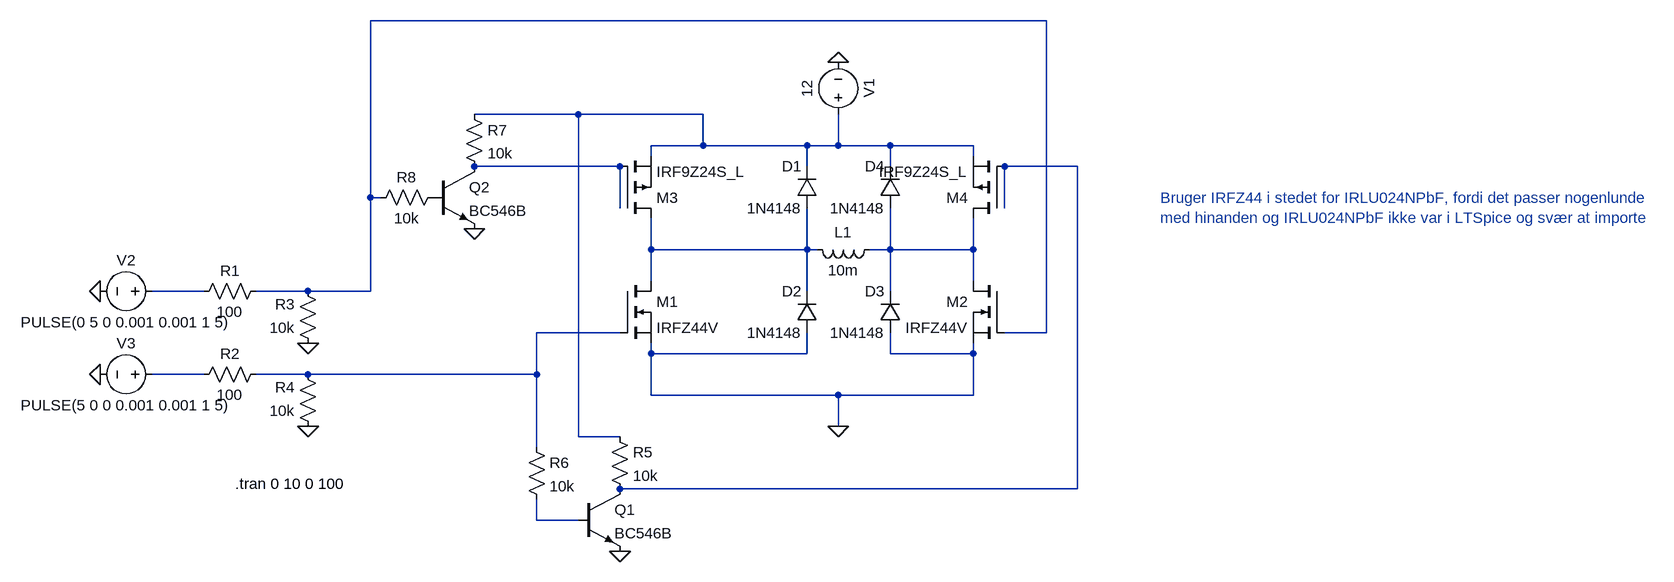
[diagram p0: schematic v1.asc]
v1.asc, the LTspice schematic file:
Version 4.1
SHEET 1 2684 680
WIRE 656 -288 -384 -288
WIRE -64 -144 -224 -144
WIRE 128 -144 -64 -144
WIRE 128 -96 128 -144
WIRE 128 -96 48 -96
WIRE 288 -96 128 -96
WIRE 336 -96 336 -144
WIRE 336 -96 288 -96
WIRE 416 -96 336 -96
WIRE 544 -96 416 -96
WIRE 48 -80 48 -96
WIRE 544 -80 544 -96
WIRE 0 -64 -224 -64
WIRE 288 -64 288 -96
WIRE 416 -64 416 -96
WIRE 704 -64 592 -64
WIRE -384 -16 -384 -288
WIRE -368 -16 -384 -16
WIRE 0 0 0 -64
WIRE 592 0 592 -64
WIRE 48 64 48 16
WIRE 288 64 288 0
WIRE 288 64 48 64
WIRE 304 64 288 64
WIRE 416 64 416 0
WIRE 416 64 384 64
WIRE 544 64 544 16
WIRE 544 64 416 64
WIRE 48 112 48 64
WIRE 544 112 544 64
WIRE -640 128 -720 128
WIRE -480 128 -560 128
WIRE -384 128 -384 -16
WIRE -384 128 -480 128
WIRE 288 128 288 64
WIRE 416 128 416 64
WIRE 0 192 -128 192
WIRE 656 192 656 -288
WIRE 656 192 592 192
WIRE 48 224 48 208
WIRE 288 224 288 192
WIRE 288 224 48 224
WIRE 416 224 416 192
WIRE 544 224 544 208
WIRE 544 224 416 224
WIRE -640 256 -720 256
WIRE -480 256 -560 256
WIRE -128 256 -128 192
WIRE -128 256 -480 256
WIRE 48 288 48 224
WIRE 336 288 48 288
WIRE 544 288 544 224
WIRE 544 288 336 288
WIRE 336 336 336 288
WIRE -64 352 -64 -144
WIRE 0 352 -64 352
WIRE -128 368 -128 256
WIRE 704 432 704 -64
WIRE 704 432 0 432
WIRE -128 480 -128 448
WIRE -64 480 -128 480
FLAG 336 336 0
FLAG -800 128 0
FLAG 336 -224 0
FLAG -800 256 0
FLAG -480 208 0
FLAG -480 336 0
FLAG -224 32 0
FLAG 0 528 0
SYMBOL nmos 0 112 R0
SYMATTR InstName M1
SYMATTR Value IRFZ44V
SYMBOL nmos 592 112 M0
SYMATTR InstName M2
SYMATTR Value IRFZ44V
SYMBOL voltage 336 -128 R180
WINDOW 0 -32 56 VBottom 2
WINDOW 3 32 56 VTop 2
WINDOW 123 0 0 Left 0
WINDOW 39 0 0 Left 0
SYMATTR InstName V1
SYMATTR Value 12
SYMBOL voltage -704 128 R90
WINDOW 0 -32 56 VBottom 2
WINDOW 3 32 56 VTop 2
WINDOW 123 0 0 Left 0
WINDOW 39 0 0 Left 0
SYMATTR InstName V2
SYMATTR Value PULSE(0 5 0 0.001 0.001 1 5)
SYMBOL ind 400 48 R90
WINDOW 0 5 56 VBottom 2
WINDOW 3 32 56 VTop 2
SYMATTR InstName L1
SYMATTR Value 10m
SYMBOL diode 304 0 R180
WINDOW 0 24 64 Left 2
WINDOW 3 24 0 Left 2
SYMATTR InstName D1
SYMATTR Value 1N4148
SYMBOL diode 304 192 R180
WINDOW 0 24 64 Left 2
WINDOW 3 24 0 Left 2
SYMATTR InstName D2
SYMATTR Value 1N4148
SYMBOL diode 432 192 R180
WINDOW 0 24 64 Left 2
WINDOW 3 24 0 Left 2
SYMATTR InstName D3
SYMATTR Value 1N4148
SYMBOL diode 432 0 R180
WINDOW 0 24 64 Left 2
WINDOW 3 24 0 Left 2
SYMATTR InstName D4
SYMATTR Value 1N4148
SYMBOL voltage -704 256 R90
WINDOW 0 -32 56 VBottom 2
WINDOW 3 32 56 VTop 2
WINDOW 123 0 0 Left 0
WINDOW 39 0 0 Left 0
SYMATTR InstName V3
SYMATTR Value PULSE(5 0 0 0.001 0.001 1 5)
SYMBOL res -544 112 R90
WINDOW 0 0 56 VBottom 2
WINDOW 3 32 56 VTop 2
SYMATTR InstName R1
SYMATTR Value 100
SYMBOL res -544 240 R90
WINDOW 0 0 56 VBottom 2
WINDOW 3 32 56 VTop 2
SYMATTR InstName R2
SYMATTR Value 100
SYMBOL res -464 224 R180
WINDOW 0 36 76 Left 2
WINDOW 3 36 40 Left 2
SYMATTR InstName R3
SYMATTR Value 10k
SYMBOL res -464 352 R180
WINDOW 0 36 76 Left 2
WINDOW 3 36 40 Left 2
SYMATTR InstName R4
SYMATTR Value 10k
SYMBOL pmos 0 16 M180
SYMATTR InstName M3
SYMATTR Value IRF9Z24S_L
SYMBOL pmos 592 16 R180
SYMATTR InstName M4
SYMATTR Value IRF9Z24S_L
SYMBOL npn -64 432 R0
SYMATTR InstName Q1
SYMATTR Value BC546B
SYMBOL npn -288 -64 R0
SYMATTR InstName Q2
SYMATTR Value BC546B
SYMBOL res -16 336 R0
SYMATTR InstName R5
SYMATTR Value 10k
SYMBOL res -240 -160 R0
SYMATTR InstName R7
SYMATTR Value 10k
SYMBOL res -144 352 R0
SYMATTR InstName R6
SYMATTR Value 10k
SYMBOL res -272 -32 R90
WINDOW 0 0 56 VBottom 2
WINDOW 3 32 56 VTop 2
SYMATTR InstName R8
SYMATTR Value 10k
TEXT -592 424 Left 2 !.tran 0 10 0 100
TEXT 832 -16 Left 2 ;Bruger IRFZ44 i stedet for IRLU024NPbF, fordi det passer nogenlunde\nmed hinanden og IRLU024NPbF ikke var i LTSpice og svær at importe

The netlist it stands for:
* v1.asc
M1 N005 N008 0 0 IRFZ44V
M2 N006 N001 0 0 IRFZ44V
V1 N002 0 12
V2 N007 0 PULSE(0 5 0 0.001 0.001 1 5)
L1 N006 N005 10m
D1 N005 N002 1N4148
D2 0 N005 1N4148
D3 0 N006 1N4148
D4 N006 N002 1N4148
V3 N009 0 PULSE(5 0 0 0.001 0.001 1 5)
R1 N001 N007 100
R2 N008 N009 100
R3 0 N001 10k
R4 0 N008 10k
M3 N005 N003 N002 N002 IRF9Z24S_L
M4 N006 N004 N002 N002 IRF9Z24S_L
Q1 N004 N010 0 0 BC546B
Q2 N003 P001 0 0 BC546B
R5 N002 N004 10k
R7 N002 N003 10k
R6 N008 N010 10k
R8 P001 N001 10k
.model D D
.lib standard.dio
.model NPN NPN
.model PNP PNP
.lib standard.bjt
.model NMOS NMOS
.model PMOS PMOS
.lib standard.mos
.tran 0 10 0 100
* Bruger IRFZ44 i stedet for IRLU024NPbF, fordi det passer nogenlunde
* med hinanden og IRLU024NPbF ikke var i LTSpice og svær at importe
.backanno
.end